# Altium schematic sheet Halbbruecke.SchDoc
size A4; SheetNumber: 2; SheetTotal: 6
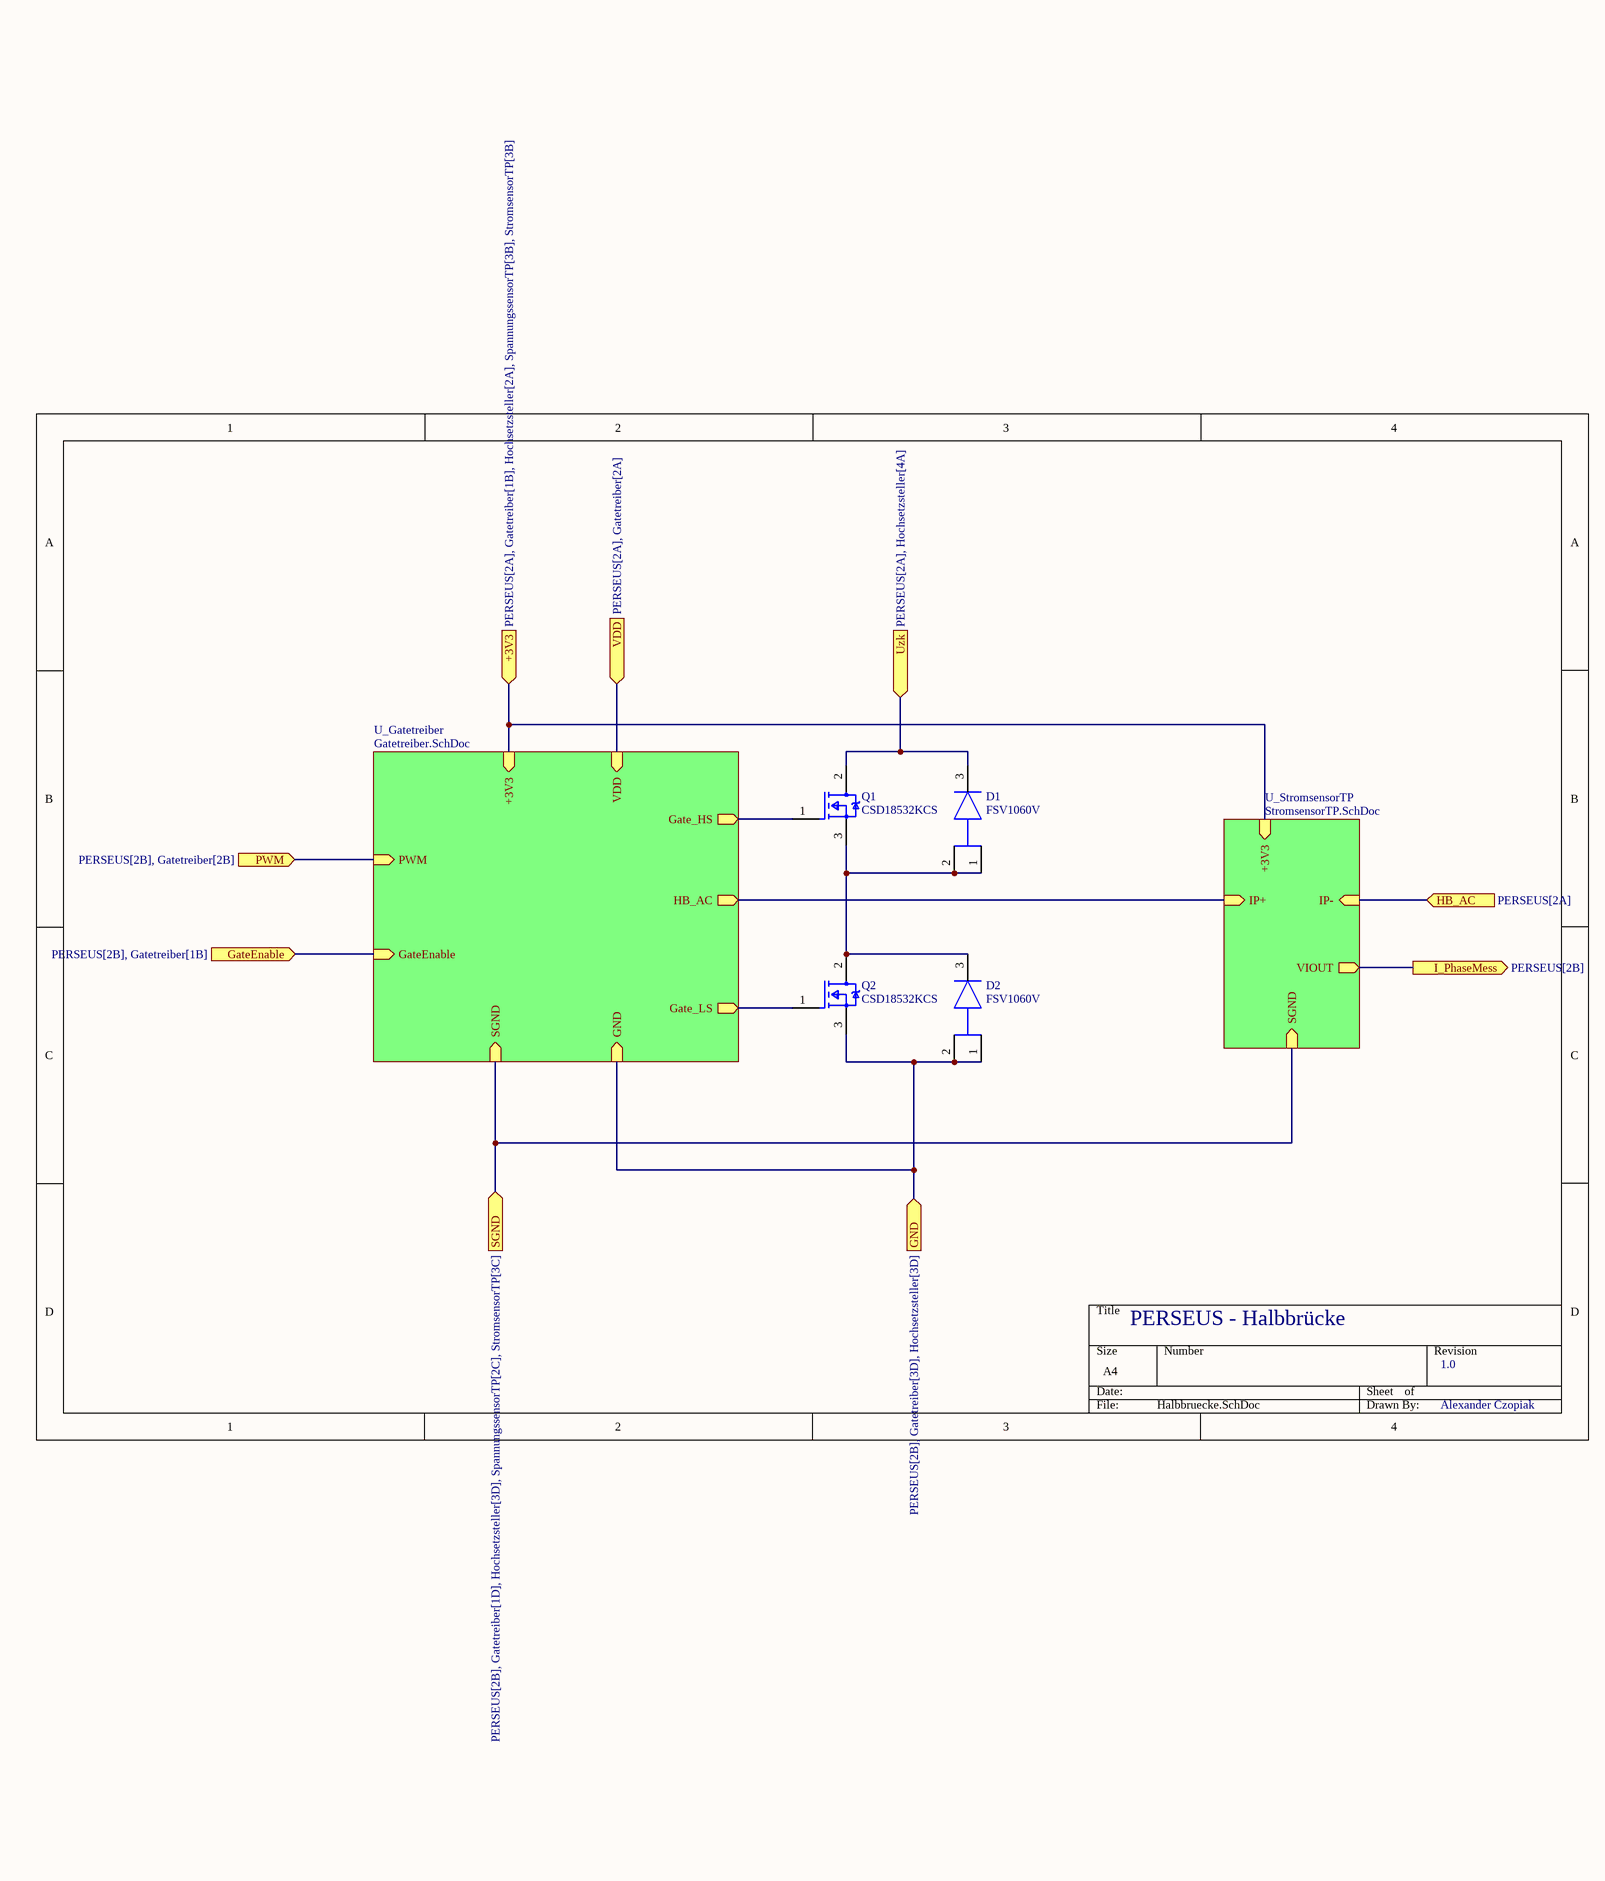
[diagram p0: Halbbruecke.SchDoc]

## Parts
D1  FSV1060V  [FP-340BQ-MFG]
D2  FSV1060V  [FP-340BQ-MFG]
Q1  CSD18532KCS  [FP-PG-TO220-3-MFG]
Q2  CSD18532KCS  [FP-PG-TO220-3-MFG]

## Sub-sheets
U_Gatetreiber = Gatetreiber.SchDoc: PWM (in), GateEnable (in), Gate_HS (out), HB_AC (out), Gate_LS (out), VDD (in), +3V3 (in), GND (in), SGND (in)
U_StromsensorTP = StromsensorTP.SchDoc: IP+ (in), VIOUT (out), SGND (in), +3V3 (in), IP- (in)

## Ports
+3V3 (in, see PERSEUS[2A], Gatetreiber[1B], Hochsetzsteller[2A], SpannungssensorTP[3B], StromsensorTP[3B]), GateEnable (in, see PERSEUS[2B], Gatetreiber[1B]), GND (in, see PERSEUS[2B], Gatetreiber[3D], Hochsetzsteller[3D]), HB_AC (in, see PERSEUS[2A]), I_PhaseMess (out, see PERSEUS[2B]), PWM (in, see PERSEUS[2B], Gatetreiber[2B]), SGND (in, see PERSEUS[2B], Gatetreiber[1D], Hochsetzsteller[3D], SpannungssensorTP[2C], StromsensorTP[3C]), Uzk (in, see PERSEUS[2A], Hochsetzsteller[4A]), VDD (in, see PERSEUS[2A], Gatetreiber[2A])

## Nets
+3V3: port +3V3, sheet U_StromsensorTP/+3V3, sheet U_Gatetreiber/+3V3
GateEnable: port GateEnable, sheet U_Gatetreiber/GateEnable
GND: D2.1(Anode_1) D2.2(Anode_2) Q2.3(SOURCE) ; port GND, sheet U_Gatetreiber/GND
HB_AC: port HB_AC, sheet U_StromsensorTP/IP-
I_PhaseMess: port I_PhaseMess, sheet U_StromsensorTP/VIOUT
PWM: port PWM, sheet U_Gatetreiber/PWM
SGND: port SGND, sheet U_StromsensorTP/SGND, sheet U_Gatetreiber/SGND
Uzk: D1.3(C) Q1.2(DRAIN) ; port Uzk
VDD: port VDD, sheet U_Gatetreiber/VDD
NetD1_1: D1.1(Anode_1) D1.2(Anode_2) D2.3(C) Q1.3(SOURCE) Q2.2(DRAIN)
NetQ1_1: Q1.1(GATE) ; sheet U_Gatetreiber/Gate_HS
NetQ2_1: Q2.1(GATE) ; sheet U_Gatetreiber/Gate_LS
(unnamed): sheet U_StromsensorTP/IP+, sheet U_Gatetreiber/HB_AC

## Notes on the sheet
- PERSEUS - Halbbrücke
- 1.0
- Alexander Czopiak

## Library data of the parts
D1 D2 = CMP-07162-000018-1: DIODE SCHOTTKY 60V 10A TO277-3; Manufacturer: ON Semiconductor; Max Junction Temp: +150°C; Max Surge Forward Current: 280A; Peak Reverse Current: 0.056mA; Capacitance: 550pF; Value: 550pF; Device Class L2: Diodes; RoHS: TRUE; Lead Free: Yes; Temperature Range High: +150°C; ComponentLink2URL: https://www.onsemi.com/pub/Collateral/FSV1060V-D.pdf; Temperature Range Low: -55°C; Max Repetitive Reverse Voltage: 60V; Footprint Url: https://www.onsemi.com/pub/Collateral/340BQ.PDF; Reverse Voltage: 60V; Device Class L1: Discrete Semiconductors; Octopart: https://octopart.com/fsv1060v-on+semiconductor-84328651; Height: 1.2mm; Digikey Description: DIODE SCHOTTKY 60V 10A TO277-3; ComponentLink2Description: Datasheet; Manufacturer Part Number: FSV1060V; Temperature: -55°C to +150°C; Package: 340BQ; Device Class L3: Schottky Diodes; Forward Current: 10A; Automotive: No; Mouser Description: Schottky Diodes & Rectifiers Schottky; Category: Diode
Q1 Q2 = CMP-32901-001154-1: MOSFET N-CH 60V 100A TO220; Polarization: N; Power Dissipation: 115W; Rds On Max: 16.5mR; Gate to Source Voltage (Vgs): 20V; Continuous Drain Current (ID): 55A; Threshold Voltage: 4V; Turn-On Delay Time: 13ns; Element Configuration: Single; Input Capacitance: 1.812nF; Turn-Off Delay Time: 40ns; Mount: Through Hole; Drain to Source Voltage (Vdss): 60V; Max Dual Supply Voltage: 60V; Length: 0.42inch; Height: 0.65inch; Width: 0.19inch; Packaging: Rail/Tube; Halogen Free: Halogen Free; Number of Pins: 3; Drain to Source Resistance: 16.5mR; Series: HEXFET®; RoHS Compliant: Yes; Reach SVHC Compliant: Yes; Drain to Source Breakdown Voltage: 60V; Max Operating Temperature: 175°C; Case/Package: TO-220; Max Power Dissipation: 115W; Lead Free: Lead Free; Min Operating Temperature: -55°C